# Altium schematic sheet LM555.SchDoc
size A4
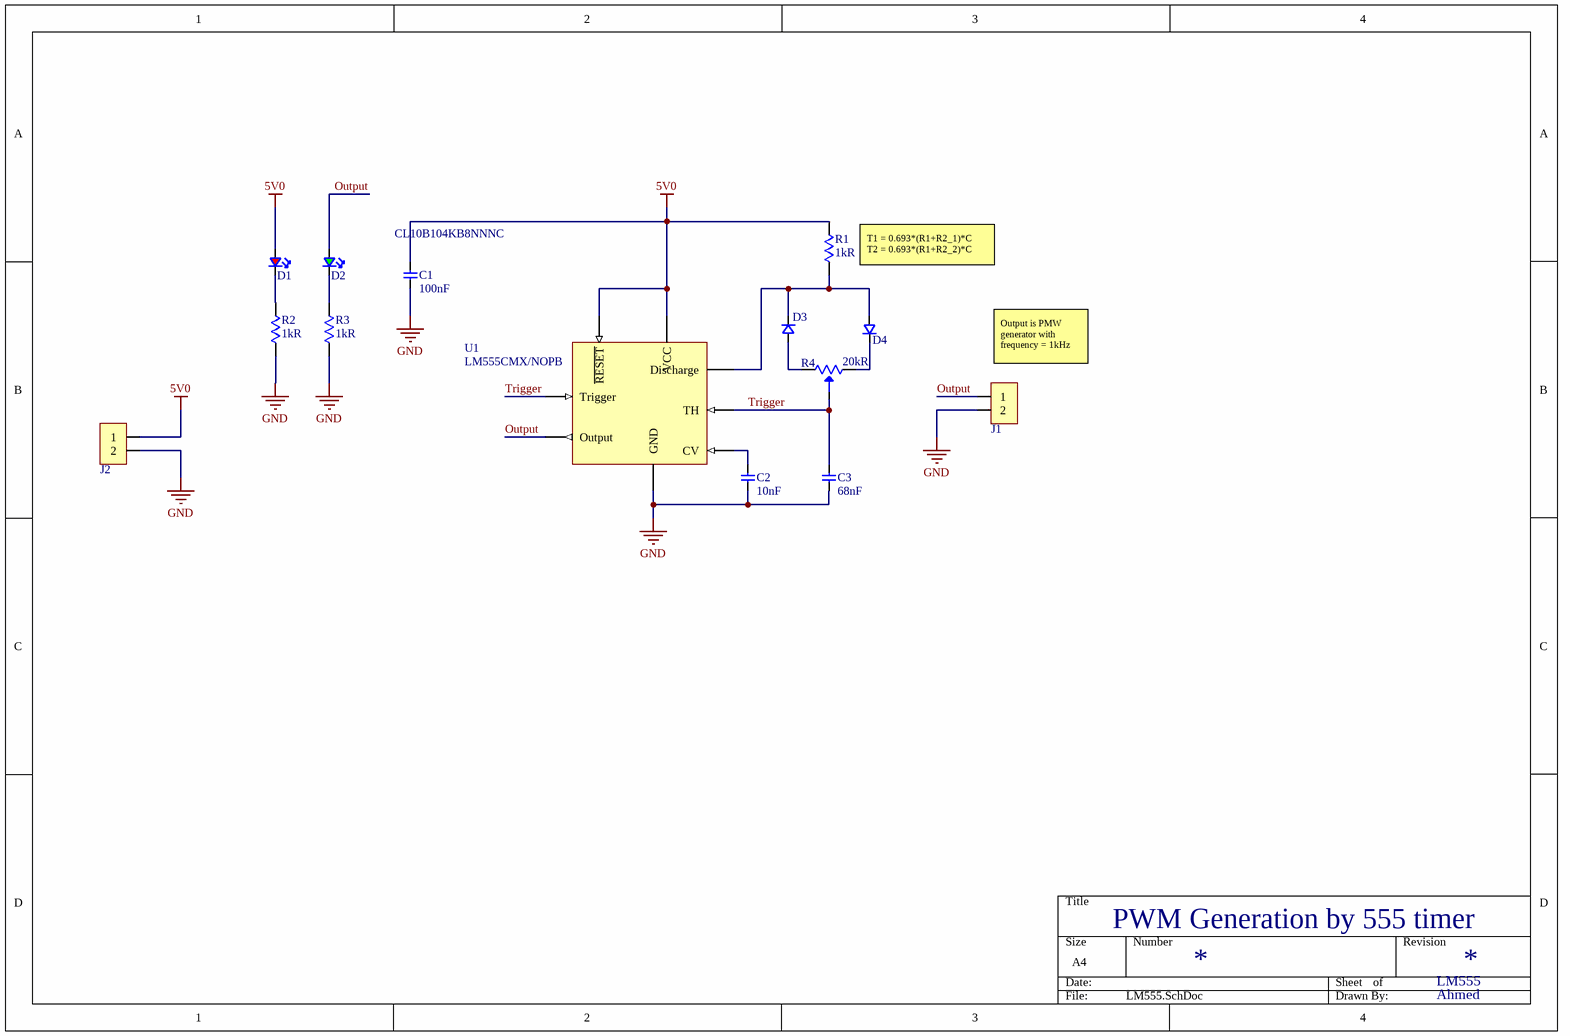
[diagram p0: LM555.SchDoc]

## Parts
C1  100nF  Manufacturer Part Number 1: CL10B104KB8NNNC  [CAP 0603]
C2  10nF  [CAP 0603]
C3  68nF  [CAP 0603]
D1  LED RED  [LED RED]  (value not drawn)
D2  LED GREEN  [LED GREEN]  (value not drawn)
D3  Diode  [SOD-323]  (value not drawn)
D4  Diode  [SOD-323]  (value not drawn)
J1  Connector  [WR-PHD Pin Header]  (value not drawn)
J2  Connector  [WR-PHD Pin Header]  (value not drawn)
R1  1kR  [RES 0603]
R2  1kR  [RES 0603]
R3  1kR  [RES 0603]
R4  20kR  [3296W-V]
U1  LM555CMX/NOPB  [SOIC]

## Nets
5V0: C1.2 D1.2 J2.1 R1.2 U1.4(~{RESET}) U1.8(VCC)
GND: C1.1 C2.1 C3.1 J1.2 J2.2 R2.1 R3.1 U1.1(GND)
Output: D2.2 J1.1 U1.3(Output)
Trigger: C3.2 R4.2 U1.2(Trigger) U1.6(TH)
NetC2_2: C2.2 U1.5(CV)
NetD1_1: D1.1 R2.2
NetD2_1: D2.1 R3.2
NetD3_1: D3.1 R4.1
NetD3_2: D3.2 D4.1 R1.1 U1.7(Discharge)
NetD4_2: D4.2 R4.3

## Notes on the sheet
- (near R1) T1 = 0.693*(R1+R2_1)*C
  T2 = 0.693*(R1+R2_2)*C
- (near J1) Output is PMW generator with frequency = 1kHz
- PWM Generation by 555 timer
- LM555
- Ahmed

## Library data of the parts
C1 = CAP  0603 100nF 10% 50 V: 0.1 µF ±10% 50V Ceramic Capacitor X7R 0603 (1608 Metric); Manufacturer 1: Samsung; Supplier 1: Digikey; Stock 1: 6418947; Pricing 1: 4000 = 0.00562, 8000 = 0.00513, 12000 = 0.00489, 28000 = 0.00464, 100000 = 0.00336, 200000 = 0.00325, 400000 = 0.00306 (USD); RoHS: Yes; Mount: Surface Mount; Case/Package: 0603; Case Code (Metric): 1608; Case Code (Imperial): 0603; Material: Ceramic; Min Operating Temperature: -55°C; Max Operating Temperature: 125°C; Capacitance: 100nF; Tolerance: 10%; Dielectric: X7R; Voltage: 50V; Voltage Rating (DC): 50V; Voltage Rating: 50V; Package Quantity: 1; Packaging: Tape and Reel; Series: CL; Construction: Flat; Length: 1.6mm; Width: 0.031inch; Height: 0.8mm; Depth: 0.8mm; Thickness: 0.035inch; Radiation Hardening: No; Lead Free: Lead Free; RoHS Compliant: Yes; ComponentLink1URL: https://datasheet.ciiva.com/25803/cl10b104kb8nnnc-25803393.pdf?src-supplier=Digikey; ComponentLink1Description: https://datasheet.ciiva.com/25803/cl10b104kb8nnnc-25803393.pdf?src-supplier=Digikey; ComponentLink2URL: https://datasheet.ciiva.com/26838/getdatasheetpartid-89097-26838411.pdf?src-supplier=Verical; ComponentLink2Description: https://datasheet.ciiva.com/26838/getdatasheetpartid-89097-26838411.pdf?src-supplier=Verical; ComponentLink3URL: https://datasheet.ciiva.com/29198/456651-da-01-en-vs-kondensator-0605-29198839.pdf?src-supplier=Conrad; ComponentLink3Description: https://datasheet.ciiva.com/29198/456651-da-01-en-vs-kondensator-0605-29198839.pdf?src-supplier=Conrad; Supplier Part Number 1: 1276-1000-2-ND; value: 100nF; Manufacturer 2: Samsung; Manufacturer Part Number 2: CL10B104KB8NNNC; Supplier 2: LCSC; Supplier Part Number 2: C1591
C2 = CAP  0603 10nF 10% 50 V: 10000 pF ±10% 50V Ceramic Capacitor X7R 0603 (1608 Metric); Manufacturer 1: Samsung; Manufacturer Part Number 1: CL10B103KB8NNND; Supplier 1: Digikey; Stock 1: 27368; Pricing 1: 1 = 0.1, 10 = 0.023, 50 = 0.0134, 100 = 0.0103, 500 = 0.00778, 1000 = 0.00611, 2500 = 0.00556, 5000 = 0.00511 (USD); RoHS: Yes; Mount: Surface Mount; Case/Package: 0603; Material: Ceramic; Min Operating Temperature: -55°C; Max Operating Temperature: 125°C; Capacitance: 10nF; Tolerance: 10%; Packaging: Tape and Reel; Voltage Rating: 50V; Dielectric: X7R; Voltage: 50V; Series: CL; Construction: Flat; Length: 1.6mm; Height: 0.8mm; Depth: 0.8mm; Radiation Hardening: No; RoHS Compliant: Yes; ComponentLink1URL: https://datasheet.ciiva.com/15195/getdatasheetpartid-357416-15195722.pdf?src-supplier=Verical; ComponentLink1Description: https://datasheet.ciiva.com/15195/getdatasheetpartid-357416-15195722.pdf?src-supplier=Verical; ComponentLink2URL: https://datasheet.ciiva.com/29198/457468-da-01-en-vs-kondensator-0603-29198646.pdf?src-supplier=Conrad; ComponentLink2Description: https://datasheet.ciiva.com/29198/457468-da-01-en-vs-kondensator-0603-29198646.pdf?src-supplier=Conrad; ComponentLink3URL: https://datasheet.ciiva.com/26310/mlcc-catalogdownload2013-eng-26310335.pdf?src-supplier=Distrelec; ComponentLink3Description: https://datasheet.ciiva.com/26310/mlcc-catalogdownload2013-eng-26310335.pdf?src-supplier=Distrelec; ComponentLink4URL: https://datasheet.ciiva.com/16449/clseries-16449357.pdf?src-supplier=Future+Electronics; ComponentLink4Description: https://datasheet.ciiva.com/16449/clseries-16449357.pdf?src-supplier=Future+Electronics; Supplier Part Number 1: 1276-CL10B103KB8NNNDDKR-ND; value: 10nF; Supplier 2: LCSC; Supplier Part Number 2: C7393880; Manufacturer 2: CCTC; Manufacturer Part Number 2: TCC0603COG103J500CT
C3 = CAP 0603  68nF 10% 50 V: 0.068 µF ±10% 50V Ceramic Capacitor X7R 0603 (1608 Metric); Manufacturer 1: Samsung; Manufacturer Part Number 1: CL10B683KB8WPNC; ComponentLink1URL: http://www.samsungsem.com/kr/support/product-search/mlcc/CL10B683KB8WPNC.jsp?src-supplier=Digikey; ComponentLink1Description: http://www.samsungsem.com/kr/support/product-search/mlcc/CL10B683KB8WPNC.jsp?src-supplier=Digikey; ComponentLink2URL: http://www.samsungsem.com/servlet/FileDownload?type=spec&file=CL10B683KB8WPNC.pdf&src-supplier=Avnet; ComponentLink2Description: http://www.samsungsem.com/servlet/FileDownload?type=spec&file=CL10B683KB8WPNC.pdf&src-supplier=Avnet; ComponentLink3URL: https://datasheet.octopart.com/CL10B683KB8WPNC-Samsung-Electro-Mechanics-datasheet-140815187.pdf?src-supplier=Future+Electronics; ComponentLink3Description: https://datasheet.octopart.com/CL10B683KB8WPNC-Samsung-Electro-Mechanics-datasheet-140815187.pdf?src-supplier=Future+Electronics; Supplier 1: Digikey; Stock 1: 223970; Pricing 1: 1 = 0.1, 10 = 0.029, 50 = 0.02, 100 = 0.0172, 500 = 0.01234, 1000 = 0.01083 (USD); RoHS: Yes; Mount: Surface Mount; Case/Package: 0603; Case Code (Metric): 1608; Case Code (Imperial): 0603; Material: Ceramic; Min Operating Temperature: -55°C; Max Operating Temperature: 125°C; Packaging: Cut Tape; Capacitance: 68nF; Voltage Rating: 50V; Tolerance: 10%; Series: CL; Height: 900um; Ratings: AEC-Q200; RoHS Compliant: Yes; Supplier Part Number 1: 1276-6541-6-ND; value: 68nF; Manufacturer 2: Murata Electronics; Manufacturer Part Number 2: GCJ188R71H683KA12D; Supplier 2: LCSC; Supplier Part Number 2: C354385
D1 = LED RED: Red 625nm LED Indication - Discrete 2V 0603 (1608 Metric); Manufacturer 1: Wurth Electronics; Manufacturer Part Number 1: 150060RS75000; Lens Color: Colorless; Viewing Angle: 140°; Lens Style: Clear,Flat,Rectangular; Luminous Intensity: 250mcd; Forward Current: 30mA; Test Current: 20mA; Lens Transparency: Clear; Max Reverse Voltage (DC): 5V; Power Dissipation: 72mW; Lens Size: 0.7mm; Supplier 1: Digikey; Stock 1: 110901; Pricing 1: 1 = 0.15, 50 = 0.142, 100 = 0.122, 500 = 0.105, 1000 = 0.10125 (USD); RoHS: Yes; Mount: Surface Mount; Case/Package: 0603; Color: Red; Case Code (Metric): 1608; Case Code (Imperial): 0603; Min Operating Temperature: -40°C; Max Operating Temperature: 85°C; Package Quantity: 1; Packaging: Cut Tape; Forward Voltage: 2V; Wavelength: 625nm; Dominant Wavelength: 625nm; Series: WL-SMCW; Reverse Voltage: 5V; Length: 1.6mm; Width: 0.8mm; Height: 0.8mm; RoHS Compliant: Yes; Reach SVHC Compliant: Unknown; ComponentLink1URL: https://datasheet.ciiva.com/29563/150060rs75000-29563040.pdf?src-supplier=Digikey; ComponentLink1Description: https://datasheet.ciiva.com/29563/150060rs75000-29563040.pdf?src-supplier=Digikey; Supplier Part Number 1: 732-4978-1-ND; Supplier 2: LCSC; Supplier Part Number 2: C128251; Manufacturer 2: Everlight Elec; Manufacturer Part Number 2: 19-213/R6C-AN2Q1B/3T
D2 = LED GREEN: Green 520nm LED Indication - Discrete 3.2V 0603 (1608 Metric); Manufacturer 1: Wurth Electronics; Manufacturer Part Number 1: 150060GS75000; Lens Color: Colorless; Viewing Angle: 140°; Lens Style: Clear,Flat,Rectangular; Luminous Intensity: 430mcd; Forward Current: 30mA; Test Current: 20mA; Lens Transparency: Clear; Max Reverse Voltage (DC): 5V; Output Current: 10uA; Power Dissipation: 105mW; Lens Size: 0.7mm; Supplier 1: Digikey; Stock 1: 149465; Pricing 1: 1 = 0.15, 50 = 0.142, 100 = 0.122, 500 = 0.105 (USD); RoHS: Yes; Mount: Surface Mount; Case/Package: 0603; Color: Green; Case Code (Metric): 1608; Case Code (Imperial): 0603; Min Operating Temperature: -40°C; Max Operating Temperature: 85°C; Wavelength: 520nm; Package Quantity: 1; Packaging: Cut Tape; Forward Voltage: 3.2V; Dominant Wavelength: 520nm; Series: WL-SMCW; Reverse Voltage: 5V; Length: 1.6mm; Width: 0.8mm; Height: 0.8mm; Lead Free: Lead Free; RoHS Compliant: Yes; Reach SVHC Compliant: Unknown; ComponentLink1URL: https://datasheet.ciiva.com/29562/150060gs75000-29562868.pdf?src-supplier=Digikey; ComponentLink1Description: https://datasheet.ciiva.com/29562/150060gs75000-29562868.pdf?src-supplier=Digikey; ComponentLink2URL: https://datasheet.ciiva.com/29279/759427-da-01-en-chipled-0603-w-kl-gruen-150060gs75000-29279201.pdf?src-supplier=Conrad; ComponentLink2Description: https://datasheet.ciiva.com/29279/759427-da-01-en-chipled-0603-w-kl-gruen-150060gs75000-29279201.pdf?src-supplier=Conrad; ComponentLink3URL: https://datasheet.ciiva.com/29562/150060gs75000-29562869.pdf?src-supplier=Digikey; ComponentLink3Description: https://datasheet.ciiva.com/29562/150060gs75000-29562869.pdf?src-supplier=Digikey; ComponentLink4URL: https://datasheet.ciiva.com/29562/150060gs75000-29562870.pdf?src-supplier=Digikey; ComponentLink4Description: https://datasheet.ciiva.com/29562/150060gs75000-29562870.pdf?src-supplier=Digikey; Supplier Part Number 1: 732-4971-1-ND; Supplier 2: LCSC; Supplier Part Number 2: C22371298; Manufacturer 2: HONGLITRONIC(Hongli Zhihui (HONGLITRONIC)); Manufacturer Part Number 2: PSC-1608U50GC-G4
D3 D4 = Diode: Diode 75 V 150mA Surface Mount SOD-323; Manufacturer 1: MCC; Manufacturer Part Number 1: 1N4148WX-TP; Max Surge Current: 2A; Recovery Time: 4ns; Forward Voltage: 1V; Forward Current: 300mA; Max Reverse Leakage Current: 5uA; Max Repetitive Reverse Voltage (Vrrm): 100V; Power Dissipation: 400mW; Polarity: Standard; Voltage Rating (DC): 75V; Capacitance: 2pF; Max Reverse Current: 1uA; Supplier 1: Digikey; Stock 1: 750805; Pricing 1: 1 = 0.1, 10 = 0.061, 100 = 0.0375, 500 = 0.02694, 1000 = 0.02349 (USD); RoHS: Yes; Mount: Surface Mount; Number of Pins: 2; Min Operating Temperature: -55°C; Max Operating Temperature: 150°C; Package Quantity: 1; Packaging: Tape and Reel; Average Rectified Current: 150mA; Reverse Recovery Time: 4ns; Peak Non-Repetitive Surge Current: 2A; Max Forward Surge Current (Ifsm): 2A; Current Rating: 300mA; Output Current: 300mA; Max Reverse Voltage (DC): 75V; Series: 1N4148; Reverse Recovery Time-Max: 4ns; Reverse Voltage: 100V; Length: 1.8mm; Width: 1.35mm; Height: 1mm; Radiation Hardening: No; Lead Free: Lead Free; RoHS Compliant: Yes; Reach SVHC Compliant: Unknown; ComponentLink1URL: https://datasheet.ciiva.com/911/1n4148wxsod323-911680.pdf?src-supplier=Digikey; ComponentLink1Description: https://datasheet.ciiva.com/911/1n4148wxsod323-911680.pdf?src-supplier=Digikey; ComponentLink2URL: https://datasheet.ciiva.com/15200/getdatasheetpartid-139691-15200368.pdf?src-supplier=Verical; ComponentLink2Description: https://datasheet.ciiva.com/15200/getdatasheetpartid-139691-15200368.pdf?src-supplier=Verical; ComponentLink3URL: https://datasheet.ciiva.com/4435/1n4148wxsod323-24388-4435234.pdf?src-supplier=Mouser; ComponentLink3Description: https://datasheet.ciiva.com/4435/1n4148wxsod323-24388-4435234.pdf?src-supplier=Mouser; ComponentLink4URL: https://datasheet.ciiva.com/22747/1684831-22747440.pdf?src-supplier=Element14; ComponentLink4Description: https://datasheet.ciiva.com/22747/1684831-22747440.pdf?src-supplier=Element14; ComponentLink5URL: https://datasheet.ciiva.com/911/1n4148wxsod323-911681.pdf?src-supplier=Digikey; ComponentLink5Description: https://datasheet.ciiva.com/911/1n4148wxsod323-911681.pdf?src-supplier=Digikey; ComponentLink6URL: https://datasheet.ciiva.com/5807/1684831-5807581.pdf?src-supplier=Farnell; ComponentLink6Description: https://datasheet.ciiva.com/5807/1684831-5807581.pdf?src-supplier=Farnell; ComponentLink7URL: https://datasheet.ciiva.com/14557/70055520-14557894.pdf?src-supplier=Allied+Electronics; ComponentLink7Description: https://datasheet.ciiva.com/14557/70055520-14557894.pdf?src-supplier=Allied+Electronics; ComponentLink8URL: https://datasheet.ciiva.com/16836/1n4148wsod123-16836295.pdf?src-supplier=Future+Electronics; ComponentLink8Description: https://datasheet.ciiva.com/16836/1n4148wsod123-16836295.pdf?src-supplier=Future+Electronics; ComponentLink9URL: https://datasheet.ciiva.com/7622/1684831-7622557.pdf?src-supplier=Element14; ComponentLink9Description: https://datasheet.ciiva.com/7622/1684831-7622557.pdf?src-supplier=Element14; ComponentLink10URL: https://datasheet.ciiva.com/22638/1684831-22638796.pdf?src-supplier=Element14; ComponentLink10Description: https://datasheet.ciiva.com/22638/1684831-22638796.pdf?src-supplier=Element14; Supplier Part Number 1: 1N4148WXTPMSCT-ND; Supplier 2: LCSC; Supplier Part Number 2: C78740; Manufacturer 2: MCC; Manufacturer Part Number 2: 1N4148WX-TP
J1 J2 = Connector: Connector Header Through Hole 2 position 0.100" (2.54mm); Manufacturer 1: Wurth Electronics; Manufacturer Part Number 1: 61300211121; Current Rating: 3A; Voltage Rating: 250V; Number of Positions: 2; Gender: 29Gender; Contact Resistance: 20mR; Pitch: 0.1inch; Supplier 1: Digikey; Stock 1: 71612; Pricing 1: 1 = 0.13, 10 = 0.113, 25 = 0.094, 50 = 0.079, 100 = 0.071, 1000 = 0.065 (USD); RoHS: Yes; Mount: Through Hole; Contact Plating: Gold; Housing Material: PBT; Contact Material: Copper Alloy,Copper; Color: Black; Min Operating Temperature: -40°C; Max Operating Temperature: 125°C; Number of Rows: 1; Contact Gender: Male; Packaging: Bulk; Termination: Through Hole; Number of Contacts: 2; Series: WR-PHD; Contact Type: Male Pin; Operating Supply Voltage: 250V; Orientation: Vertical; Height: 8.94mm; Contact Mating Length: 0.236inch; Lead Free: Lead Free; RoHS Compliant: Yes; Reach SVHC Compliant: Unknown; ComponentLink1URL: https://datasheet.ciiva.com/13619/6130xx11121-48870-13619345.pdf?src-supplier=Mouser; ComponentLink1Description: https://datasheet.ciiva.com/13619/6130xx11121-48870-13619345.pdf?src-supplier=Mouser; Supplier Part Number 1: 732-5315-ND; Manufacturer Part Number 2: PREC001SFAN-RC; Manufacturer 2: Sullins Connector Solutions; Supplier 2: LCSC; Supplier Part Number 2: C3326568
R1-R3 = RES  0603 1kR ±1% 0.1W: 1 kOhms ±1% 0.1W, 1/10W Chip Resistor 0603 (1608 Metric) Moisture Resistant Thick Film; Manufacturer: Yageo; Manufacturer Part Number 1: RC0603FR-071KL; Voltage Rating: 50V; Power Rating: 100mW; Temperature Coefficient: 100ppm/°C; Supplier 1: Future Electronics; Stock 1: 15835000; Pricing 1: 5000 = 0.0014, 50000 = 0.0014, 150000 = 0.0013, 375000 = 0.0013, 1000000 = 0.0012 (USD); RoHS: Yes; Case/Package: 0603; Case Code (Imperial): 0603; Case Code (Metric): 1608; Min Operating Temperature: -55°C; Max Operating Temperature: 155°C; Packaging: Tape and Reel; Resistance: 1kR; Tolerance: 1%; Termination: SMD/SMT; Resistor Type: Thick Film; Features: Moisture Resistant; Series: RC; Max Power Dissipation: 100mW; Number of Terminations: 2; Resistance Tolerance: 1%; Construction: Rectangular; Length: 1.6mm; Height: 0.45mm; Depth: 0.8mm; Reach SVHC Compliant: No; Military Standard: Not; Lead Free: Lead Free; RoHS Compliant: Yes; ComponentLink5URL: http://www.yageo.com/documents/recent/PYu-RC_Group_51_RoHS_L_9.pdf?src-supplier=Arrow+Electronics; ComponentLink5Description: http://www.yageo.com/documents/recent/PYu-RC_Group_51_RoHS_L_9.pdf?src-supplier=Arrow+Electronics; ComponentLink6URL: https://datasheet.octopart.com/RC0603FR-0710KL-Yageo-datasheet-15599030.pdf?src-supplier=Future+Electronics; ComponentLink6Description: https://datasheet.octopart.com/RC0603FR-0710KL-Yageo-datasheet-15599030.pdf?src-supplier=Future+Electronics; Supplier Part Number 1: 4016291; value: 1kR; Contact Plating: Tin,Matte; Technology: THICK FILM; Supplier 2: LCSC; Supplier Part Number 2: C728580; Manufacturer Part Number 2: RT0603BRB071KL
R4 = POT RES  4030 20kR 5% 0.05W: ±10% 20kΩ Plugin Potentiometers, Variable Resistors ROHS; Manufacturer 1: Bourns; Manufacturer Part Number 1: 3296W-1-203; Number of Turns: 25; Max Power Dissipation: 500mW; Temperature Coefficient: 100ppm/°C; Voltage Rating (DC): 500V; ComponentLink1URL: https://datasheet.ciiva.com/8701/ptv09-8701401.pdf?src-supplier=Avnet; ComponentLink1Description: https://datasheet.ciiva.com/8701/ptv09-8701401.pdf?src-supplier=Avnet; Supplier 1: Digikey; Stock 1: 296; Pricing 1: 1 = 4.43, 10 = 3.874, 25 = 3.4592, 50 = 3.2516, 100 = 3.1825, 250 = 3.04416, 500 = 2.49066, 1000 = 2.14474, 5000 = 1.93718 (USD); RoHS: No; Mount: Through Hole,Panel; Weight: 0.03oz; Contact Plating: Tin,Lead; Color: Blue; Min Operating Temperature: -55°C; Max Operating Temperature: 125°C; Packaging: Rail/Tube; Resistance: 20kR; Tolerance: 10%; Termination: Pin; Series: Trimpot® 3296 - Sealed; Power Rating: 500mW; Taper: Linear; Resistor Type: Cermet; Technology: CERMET; Resistance Tolerance: 10%; Length: 9.53mm; Width: 9.53mm; Depth: 4.83mm; Radiation Hardening: No; RoHS Compliant: No; Military Standard: Not; Reach SVHC Compliant: No; Lead Free: Contains Lead; ComponentLink2URL: https://datasheet.ciiva.com/2164/3296-2164078.pdf?src-supplier=Digikey; ComponentLink2Description: https://datasheet.ciiva.com/2164/3296-2164078.pdf?src-supplier=Digikey; ComponentLink3URL: https://datasheet.ciiva.com/8088/3296-8088796.pdf?src-supplier=Avnet; ComponentLink3Description: https://datasheet.ciiva.com/8088/3296-8088796.pdf?src-supplier=Avnet; ComponentLink4URL: https://datasheet.ciiva.com/30173/3296-30173435.pdf?src-supplier=Onlinecomponents.com; ComponentLink4Description: https://datasheet.ciiva.com/30173/3296-30173435.pdf?src-supplier=Onlinecomponents.com; ComponentLink5URL: https://datasheet.ciiva.com/15211/getdatasheetpartid-62505-15211741.pdf?src-supplier=Verical; ComponentLink5Description: https://datasheet.ciiva.com/15211/getdatasheetpartid-62505-15211741.pdf?src-supplier=Verical; ComponentLink6URL: https://datasheet.ciiva.com/1570/1815117-1570422.pdf?src-supplier=Newark; ComponentLink6Description: https://datasheet.ciiva.com/1570/1815117-1570422.pdf?src-supplier=Newark; Supplier 2: LCSC; Supplier Part Number 2: C118936; Manufacturer 2: BOCHEN; Manufacturer Part Number 2: 3296W-1-203; Supplier Part Number 1: 3296W-203-ND
U1 = LM555CMX/NOPB: 555 Type, Timer/Oscillator (Single) IC 100kHz 8-SOIC; Manufacturer 1: TI National Semiconductor; Manufacturer Part Number 1: LM555CM/NOPB; Min Supply Voltage: 4.5V; Max Supply Voltage: 16V; Number of Timers/Counters: 1; High Level Output Current: -200mA; Low Level Output Current: 200mA; Max Power Dissipation: 1.18W; Operating Supply Current: 10mA; Quiescent Current: 3mA; Operating Supply Voltage: 5V; ComponentLink1URL: https://datasheet.ciiva.com/19457/840579-19457377.pdf?src-supplier=Jameco; ComponentLink1Description: https://datasheet.ciiva.com/19457/840579-19457377.pdf?src-supplier=Jameco; ComponentLink2URL: https://datasheet.ciiva.com/6668/lm555-6668279.pdf?src-supplier=Digikey; ComponentLink2Description: https://datasheet.ciiva.com/6668/lm555-6668279.pdf?src-supplier=Digikey; ComponentLink3URL: https://datasheet.ciiva.com/14094/djnat-timer-lm-555c-en-14094965.pdf?src-supplier=Distrelec; ComponentLink3Description: https://datasheet.ciiva.com/14094/djnat-timer-lm-555c-en-14094965.pdf?src-supplier=Distrelec; ComponentLink4URL: https://datasheet.ciiva.com/1492/1902863-1492440.pdf?src-supplier=Element14; ComponentLink4Description: https://datasheet.ciiva.com/1492/1902863-1492440.pdf?src-supplier=Element14; ComponentLink5URL: https://datasheet.ciiva.com/3305/lm555-3305560.pdf?src-supplier=Avnet; ComponentLink5Description: https://datasheet.ciiva.com/3305/lm555-3305560.pdf?src-supplier=Avnet; Supplier 1: Digikey; Stock 1: 2526; Pricing 1: 1 = 1.37, 10 = 1.228, 95 = 0.95705, 285 = 0.89467, 570 = 0.79063, 1045 = 0.62418, 2565 = 0.58257, 5035 = 0.55344 (USD); RoHS: Yes; Mount: Surface Mount; Case/Package: SOIC; Number of Pins: 8; Min Operating Temperature: 0°C; Max Operating Temperature: 70°C; Packaging: Rail/Tube; Series: -; Package Quantity: 95; Power Dissipation: 1.18W; Frequency: 100kHz; Supply Current: 3mA; Current Rating: 3mA; Number of Channels: 1; Output Current: 200mA; Termination: SMD/SMT; Voltage: 16V; Length: 4.9mm; Width: 3.9mm; Height: 1.45mm; Thickness: 1.58mm; Radiation Hardening: No; RoHS Compliant: Yes; Lead Free: Lead Free; Reach SVHC Compliant: No; Supplier Part Number 1: LM555CM/NOPB-ND; Supplier 2: LCSC; Supplier Part Number 2: C543060; Manufacturer 2: Texas Instruments; Manufacturer Part Number 2: LM555CMX/NOPB